# EAGLE design usb300 (EAGLE 4.15)
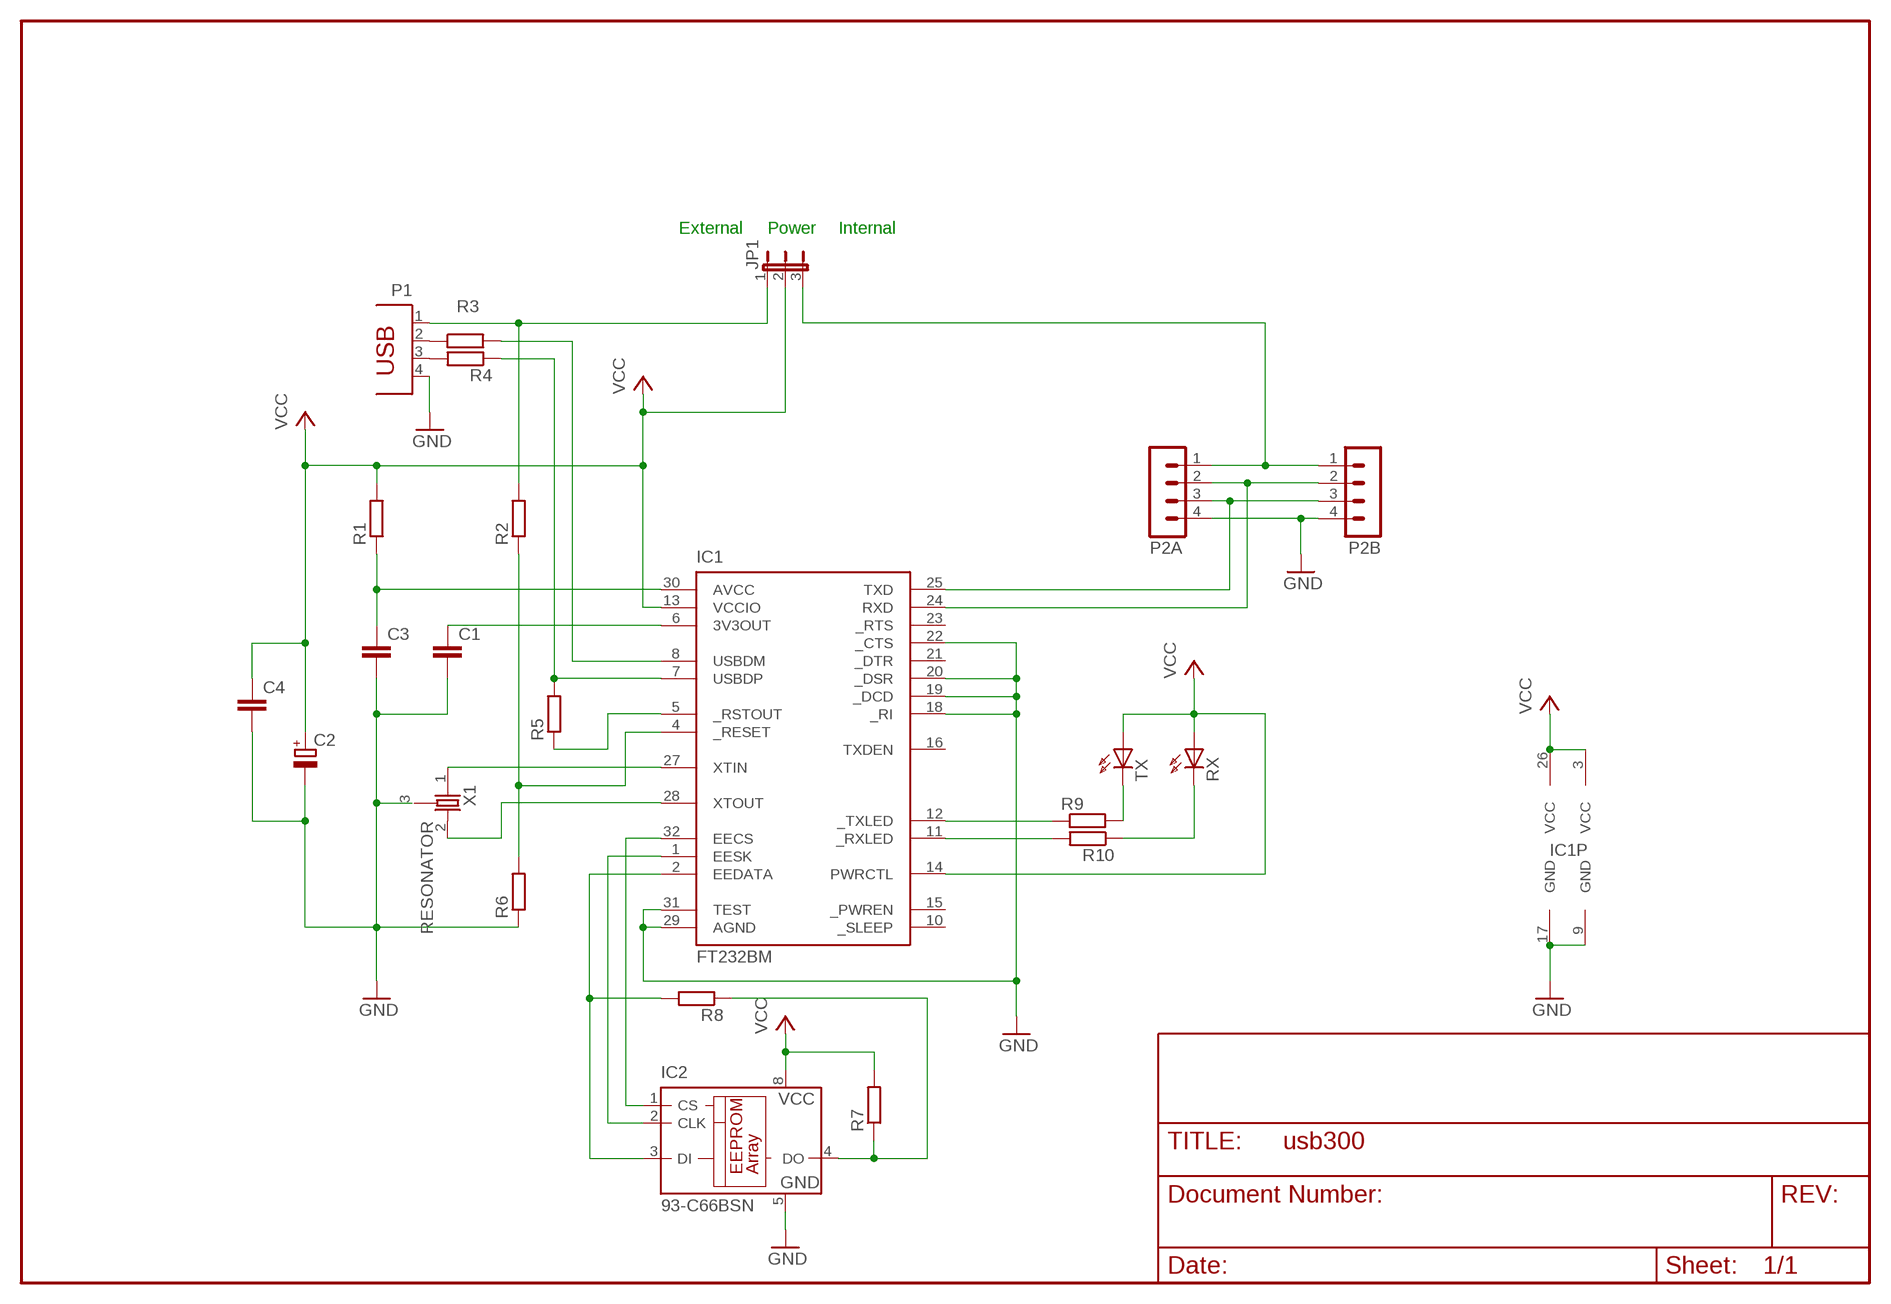
[diagram p0: schematic, sheet 1]

## Parts
C1  C-EUC0805K  [C0805K]
C2  CPOL-EUCT3528  [CT3528]
C3  C-EUC0805K  [C0805K]
C4  C-EUC0805K  [C0805K]
IC1  FT232BM  [LQFP32]
IC2  93-C66BSN  [SO-08]
JP1  JP2E  [JP2]
P1  PN61729  [PN61729]
P2A  MA04-1  [MA04-1]
P2B  MA04-1  [MA04-1]
R1  R-EU_R0805W  [R0805W]
R2  R-EU_R0805W  [R0805W]
R3  R-EU_R0805W  [R0805W]
R4  R-EU_R0805W  [R0805W]
R5  R-EU_R0805W  [R0805W]
R6  R-EU_R0805W  [R0805W]
R7  R-EU_R0805W  [R0805W]
R8  R-EU_R0805W  [R0805W]
R9  R-EU_R0805W  [R0805W]
R10  R-EU_R0805W  [R0805W]
RX  LEDSMT1206  [1206]
TX  LEDSMT1206  [1206]
X1  RESONATOR  [RESONATOR]

## Nets
GND [power]: C1.2 C2.- C3.2 C4.2 IC1.9(GND) IC1.17(GND) IC1.18(_RI) IC1.19(_DCD) IC1.20(_DSR) IC1.22(_CTS) IC1.29(AGND) IC1.31(TEST) IC2.5(GND) P1.4 P2A.4 P2B.4 R6.1 X1.3
N$1: C3.1 IC1.30(AVCC) R1.1
N$2: IC1.25(TXD) P2A.3 P2B.3
N$3: IC1.24(RXD) P2A.2 P2B.2
N$4: IC2.4(DO) R7.1 R8.1
N$5: IC1.27(XTIN) X1.1
N$6: IC1.28(XTOUT) X1.2
N$7: IC1.7(USBDP) R4.1 R5.2
N$8: IC1.5(_RSTOUT) R5.1
N$9: JP1.1 P1.1 R2.2
N$11: IC1.8(USBDM) R3.2
N$12: P1.3 R4.2
N$13: P1.2 R3.1
N$14: IC1.4(_RESET) R2.1 R6.2
N$15: IC1.2(EEDATA) IC2.3(DI) R8.2
N$16: IC1.1(EESK) IC2.2(CLK)
N$17: C1.1 IC1.6(3V3OUT)
N$18: IC1.32(EECS) IC2.1(CS)
N$19: R10.1 RX.C
N$20: R9.2 TX.C
N$22: IC1.12(_TXLED) R9.1
N$23: IC1.11(_RXLED) R10.2
N$24 [power]: JP1.3 P2A.1 P2B.1
VCC: C2.+ C4.1 IC1.3(VCC) IC1.13(VCCIO) IC1.14(PWRCTL) IC1.26(VCC) IC2.8(VCC) JP1.2 R1.2 R7.2 RX.A TX.A
Unconnected: IC1.10(_SLEEP) IC1.15(_PWREN) IC1.16(TXDEN) IC1.21(_DTR) IC1.23(_RTS)

## Notes on the sheet
- External | Power | Internal

## Library data of the parts
C1 C3 C4 = rcl:C-EU: CAPACITOR, European symbol
C2 = rcl:CPOL-EU: POLARIZED CAPACITOR, European symbol
IC1 = ftdi3:FT232BM: USB UART 2nd Generation USB UART (USB <-> Serial)
IC2 = microchip:93-*: Serial EEPROM 512 x 8 bit/256 x 16 bit/1 K/4 K, 5.0 V, Microwire
JP1 = jumper:JP2E: JUMPER
P1 = con-berg:PN61729: BERG
P2A P2B = con-lstb:MA04-1: PIN HEADER
R1-R10 = rcl:R-EU_: RESISTOR, European symbol
RX TX = led:LED: LED
X1 = lbm:RESONATOR

## Net classes
0 default: width 0.203 mm, drill 0.203 mm
1 power: width 0.508 mm, drill 0.203 mm

## Board
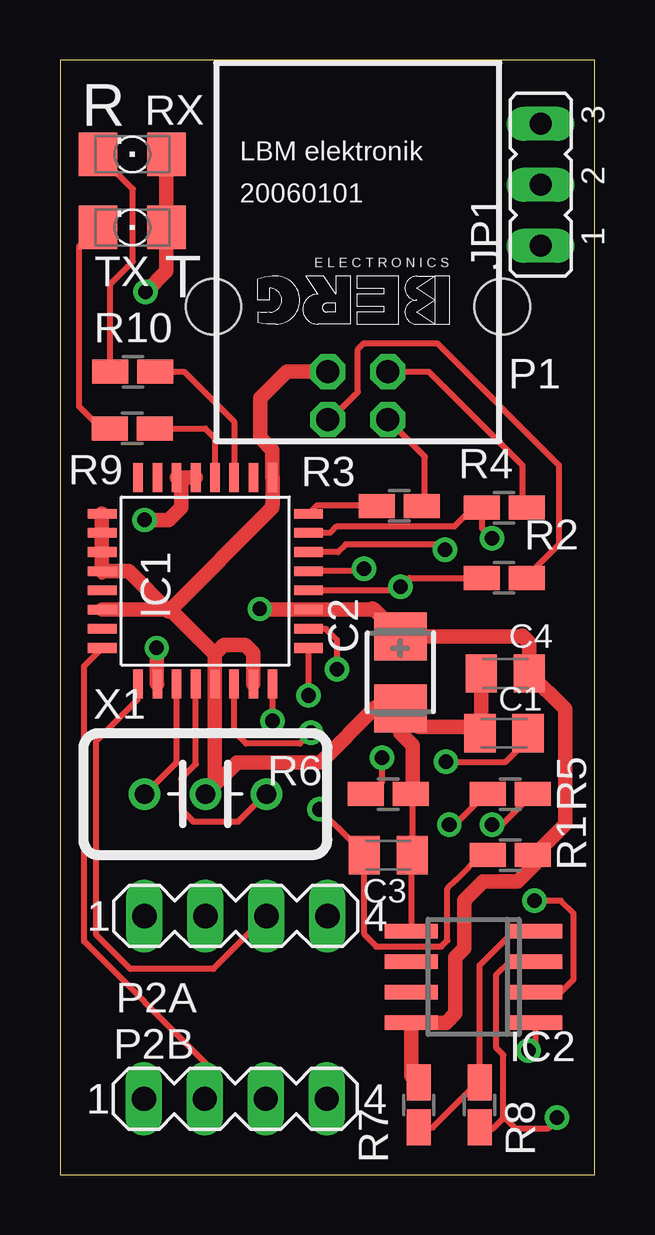
[diagram p1: board, top side]
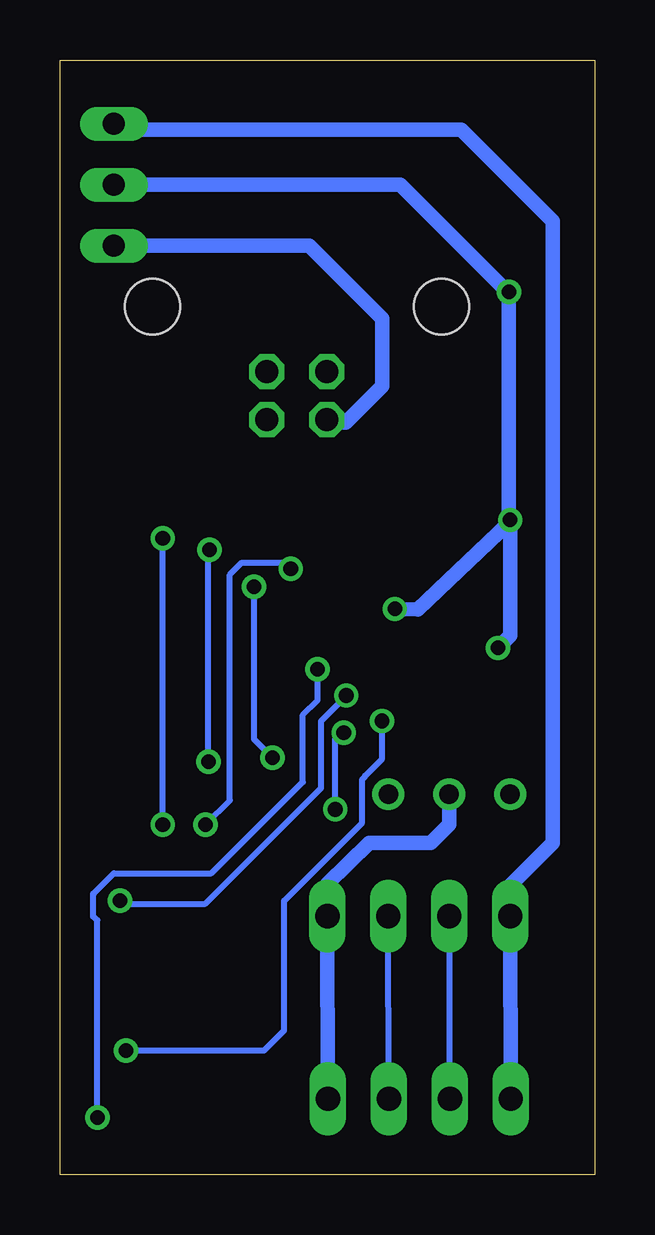
[diagram p2: board, bottom side, seen from below]

Size 22.28 x 46.47 mm. Coordinates in mm from the lower left corner, seen from the top.
Outline: 0,0 22.28,0 22.28,46.47 0,46.47 0,0
Copper layers (1*16): Top 0.035mm / dielectric 1.5mm / Bottom 0.035mm
Design rules "default": minimum track width 8mil, minimum drill 23mil, track to track 8mil, track to pad 8mil, pad to pad 8mil, via to via 8mil, smd to smd 8mil, copper to edge 20mil, drill to drill 8mil, minimum pad ring 10mil, minimum via ring 8mil, stop-mask expansion 4mil, vias tented up to drill 0mil, thermal gap 10mil

### Footprints (pad centres in the part's own frame; a part is rotated, then mirrored left to right if it is on the bottom)
C0805K = smd 1.3 x 1.6: 1 -1,0; 2 1,0
CT3528 = smd 2 x 2.2: + 1.5,0; - -1.5,0
LQFP32 = smd 0.4 x 1.2: 1 -2.8,-4.3; 2 -2,-4.3; 3 -1.2,-4.3; 4 -0.4,-4.3; 5 0.4,-4.3; 6 1.2,-4.3; 7 2,-4.3; 8 2.8,-4.3; 17 2.8,4.3; 18 2,4.3; 19 1.2,4.3; 20 0.4,4.3; 21 -0.4,4.3; 22 -1.2,4.3; 23 -2,4.3; 24 -2.8,4.3 | smd 1.2 x 0.4: 9 4.3,-2.8; 10 4.3,-2; 11 4.3,-1.2; 12 4.3,-0.4; 13 4.3,0.4; 14 4.3,1.2; 15 4.3,2; 16 4.3,2.8; 25 -4.3,2.8; 26 -4.3,2; 27 -4.3,1.2; 28 -4.3,0.4; 29 -4.3,-0.4; 30 -4.3,-1.2; 31 -4.3,-2; 32 -4.3,-2.8
SO-08 = smd 0.6 x 2.2: 1 -1.905,-2.6; 2 -0.635,-2.6; 3 0.635,-2.6; 4 1.905,-2.6; 5 1.905,2.6; 6 0.635,2.6; 7 -0.635,2.6; 8 -1.905,2.6
JP2 = drill 0.914 long: 1 -2.54,0; 2 0,0; 3 2.54,0
PN61729 = drill 0.95 octagon: 1 1.25,4.71; 2 -1.25,4.71; 3 -1.25,2.71; 4 1.25,2.71 | hole 2.3: -6.02,0; 6.02,0
MA04-1 = drill 1.016 long: 1 -3.81,0; 2 -1.27,0; 3 1.27,0; 4 3.81,0
R0805W = smd 1.5 x 1: 1 -0.94,0; 2 0.94,0
1206 = smd 1.6 x 1.803: A -1.422,0; C 1.422,0
RESONATOR = drill 0.813 round: 1 -7.62,0; 2 -2.54,0; 3 -5.08,0

### Placement (x,y rotation side)
C1  18.5,18.41 180 top
C2  14.19,20.95 90 top
C3  13.68,13.33 0 top
C4  18.55,20.9 180 top
IC1  6.06,24.76 90 top
IC2  17.23,8.25 90 top
JP1  20.03,41.27 90 top
P1  12.41,36.19 180 top
P2A  7.33,10.79 0 top
P2B  7.3,3.17 0 top
R1  18.76,13.33 0 top
R2  18.5,24.89 0 top
R3  14.14,27.88 180 top
R4  18.5,27.81 0 top
R5  18.76,15.87 0 top
R6  13.68,15.87 180 top
R7  14.95,2.92 90 top
R8  17.49,2.92 270 top
R9  3.01,31.11 180 top
R10  3.04,33.47 0 top
RX  3.01,42.54 180 top
TX  3.01,39.49 180 top
X1  11.14,15.87 0 top

### Tracks (layer width: path | path; a pad name or v marks a point on that pad's centre or on a via)
GND
  Top 0.254: IC2.5 14.63,13.27 14.69,13.33 C3.2 14.68,15.76 14.57,15.87 R6.1
  Top 0.406: 1.74,27.56 IC1.17 | 1.74,26.76 IC1.18 | 1.74,25.01 1.74,25.16 IC1.20 | 1.74,25.96 IC1.19
  Top 0.61: IC1.31 8.06,21.74 7.71,22.09 6.82,22.09 6.44,21.71 | 6.44,20.44 IC1.29 | 6.44,20.44 6.44,21.71 | 4.53,23.56 4.59,23.56 6.44,21.71 | 4.53,23.56 IC1.22 | P1.4 9.44,33.48 8.34,32.38 8.34,30.73 8.85,30.22 8.85,29.08 8.86,29.07 IC1.9 8.86,27.94 8.85,27.93 8.85,27.81 4.53,23.49 | 17.49,18.66 17.5,18.65 C1.2 | C4.2 17.56,18.73 17.49,18.66 | 14.24,19.45 14.23,19.45 C2.- | 6.44,20.44 6.44,16.25 X1.3 7.38,17.19 10.86,17.19 13.14,19.48 14.19,19.48 C2.- | 4.53,23.56 4.53,23.49 | 1.74,27.56 1.74,26.76 1.74,25.96 1.74,25.16 | IC1.20 2.86,25.16 4.53,23.49 | 14.19,19.43 14.19,18.41 14.69,17.9 14.69,15.87 R6.1 | C2.- 14.19,19.43 | 17.49,18.66 14.95,18.66 14.19,19.43
  Bottom 0.61: P2B.4 P2A.4 11.14,12.14 9.38,13.84 6.82,13.84 6.06,14.6 X1.3
N$1  (via drill 0.61)
  Top 0.254: 16.52,12.31 17.54,13.33 | C3.1 12.69,10.03 13.17,9.52 15.89,9.52 16.14,9.77 16.14,11.93 16.52,12.31 | IC1.30 7.26,18.48 7.76,17.98 9.99,17.98 v10.45,18.43 | C3.1 12.68,13.37 12.69,13.38 11.62,14.45 v10.81,15.24 | 16.52,12.31 16.5,12.29
  Top 0.305: 17.54,13.33 R1.1 | 12.69,13.36 C3.1
  Bottom 0.254: v10.45,18.43 10.81,18.16 v10.81,15.24
N$2
  Top 0.254: P2A.3 6.39,8.58 2.93,8.58 1.51,10 1.51,18.08 3.24,19.81 3.24,20.47 IC1.25
  Bottom 0.254: 8.6,3.15 P2B.3 P2A.3
N$3
  Top 0.254: IC1.24 1,21.2 1,9.72 6.06,4.67 6.06,3.17 P2B.2
  Bottom 0.254: P2A.2 6.06,10.82 6.03,10.79 P2B.2
N$4
  Top 0.254: IC2.4 18.91,10.16 17.49,8.73 17.49,3.88 17.46,3.86 | 17.46,3.86 | 17.46,3.86 R8.1 17.41,3.86 15.53,1.98 15.02,1.98 | 15.02,1.98 | R7.1 15.02,1.98
N$5
  Top 0.254: IC1.27 4.86,17.18 3.52,15.85
  Top 0.305: 3.49,15.82 3.52,15.85 X1.1
N$6
  Top 0.254: IC1.28 5.66,17.12 5.14,16.61 | 5.07,16.5 5.07,15.21 5.55,14.73 7.43,14.73 8.6,15.9
  Top 0.305: 5.14,16.61 5.14,16.58 5.07,16.5 | 8.6,15.9 X1.2
N$7  (via drill 0.61)
  Top 0.254: IC1.7 11.26,26.76 11.52,27.02 16.42,27.02 17.18,27.78 17.59,27.78 | 17.59,27.78 | 17.59,27.78 R4.1 17.59,27.81 17.59,26.94 v18,26.54 | R5.2 18.43,14.6 v18,14.6
  Bottom 0.254: v18,14.6 v18,26.54
N$8  (via drill 0.61)
  Top 0.254: IC1.5 12.55,25.16 v12.66,25.27 | R5.1 17.74,15.87 16.47,14.6 v16.22,14.6
  Bottom 0.254: v12.66,25.27 12.92,25.52 14.69,25.52 15.2,25.01 15.2,15.62 v16.22,14.6
N$9
  Top 0.254: P1.1 11.25,31.48 12.41,32.63 12.41,34.41 12.66,34.67 15.71,34.67 20.79,29.59 20.79,26.28 19.44,24.94 R2.2
  Bottom 0.61: JP1.1 11.9,38.73 8.85,35.68 8.85,32.89 10.38,31.36 11.14,31.36 11.14,31.46 P1.1
N$11
  Top 0.254: R3.2 13.2,27.91 10.71,27.91 IC1.8 | R3.2
N$12
  Top 0.254: P1.3 15.37,33.48 19.27,29.59 19.27,28.06 19.52,27.81 R4.2
N$13
  Top 0.254: R3.1 15.15,27.81 15.2,27.81 15.2,29.94 P1.2
N$14  (via drill 0.61)
  Top 0.254: IC1.4 14.04,24.36 v14.19,24.51 14.57,24.89 R2.1 | v13.42,17.39 13.42,16.38 12.92,15.87 R6.2 12.66,15.87
  Bottom 0.254: v14.19,24.51 14.19,18.16 v13.42,17.39
N$15  (via drill 0.61)
  Top 0.254: IC2.3 18.73,8.89 18.17,8.33 18.17,5.3 18.48,5 18.48,2.41 | 18.48,2.41 18.48,2.33 | IC1.2 11.08,22.76 11.54,22.3 v11.54,21.08 | v20.71,2.38 20.36,1.95 18.96,1.95 18.5,2.41 | 18.5,2.41 18.48,2.41 | 18.5,2.41 18.05,1.95 18,1.9 17.92,1.98 R8.2
  Bottom 0.254: v20.71,2.38 20.71,10.61 20.89,10.77 20.89,11.73 20.87,11.73 20.03,12.57 15.96,12.57 12.15,16.38 12.15,19.17 11.54,19.78 v11.54,21.08
N$16  (via drill 0.61)
  Top 0.254: IC1.1 10.36,19.99 v10.35,19.98 | v19.77,11.43 20.87,11.43 21.4,10.89 21.4,8.15 20.87,7.62 IC2.2
  Bottom 0.254: v10.35,19.98 10.35,19.96 11.39,18.92 11.39,16.12 16.22,11.3 19.77,11.3 v19.77,11.43
N$17  (via drill 0.61)
  Top 0.254: 19.47,18.45 19.47,18.46 | 19.47,18.45 C1.1 | v16.09,17.22 18.58,17.22 19.47,18.11 19.47,18.45 | IC1.6 11.58,25.96 11.9,26.28 15.71,26.28 15.94,26.05 v16.04,26.05
  Bottom 0.254: v16.04,26.05 16.09,26.18 v16.09,17.22
N$18  (via drill 0.61)
  Top 0.254: IC1.32 8.86,19.28 v8.85,18.92 | IC2.1 19.83,6.36 19.83,6.37 19.83,5.48 v19.52,5.18
  Bottom 0.254: v8.85,18.92 8.85,17.34 9.56,16.63 9.56,16.61 9.69,16.48 9.69,14.68 12.94,11.43 12.94,6.01 13.78,5.18 v19.52,5.18
N$19
  Top 0.254: RX.C 3.04,41.09 3.04,38.07 2.1,37.13 2.1,33.57 2.09,33.57 R10.1
N$20
  Top 0.254: TX.C 0.8,38.7 0.8,32.02 1.71,31.11 R9.2
N$22
  Top 0.254: IC1.12 6.46,30.71 6.06,31.11 R9.1
N$23
  Top 0.254: R10.2 5.17,33.47 7.25,31.39 IC1.11
N$24
  Bottom 0.61: P2B.1 P2A.1 3.52,12.06 1.74,13.84 1.74,39.75 5.55,43.56 19.77,43.56 JP1.3
VCC  (via drill 0.6, 0.61)
  Top 0.61: 13.16,23.48 13.02,23.62 | 4.43,39.57 | 4.43,39.57 TX.A 4.43,37.66 v3.57,36.8 | RX.A 4.43,39.57 | v3.52,27.3 4.53,27.3 5.04,27.81 5.04,28.88 IC1.14 4.9,29.06 4.92,29.08 4.93,29.06 IC1.13 | IC1.26 4.03,20.49 v4.03,21.97 | v8.33,23.59 8.33,23.51 8.34,23.49 8.41,23.56 IC1.3 13.1,23.56 13.17,23.49 13.16,23.48 | 13.16,23.48 13.18,23.48 14.19,22.47 C2.+ 19.24,22.45 19.27,22.47 19.56,22.18 C4.1 21.04,19.41 21.04,14.6 19.77,13.33 R1.2 19.7,13.03 19.77,12.95 19.06,12.24 17.64,12.24 16.85,11.45 16.85,9.44 16.47,9.06 16.47,6.73 16.09,6.34 IC2.8 14.63,4.12 14.95,3.8 R7.2
  Bottom 0.61: 3.57,27.55 3.57,27.17 7.38,23.57 v8.33,23.59 | 3.57,27.55 v3.57,36.8 3.57,36.75 | 3.57,36.75 3.52,36.7 | JP1.2 8.09,41.27 3.57,36.75 | 3.57,27.55 3.52,27.55 v3.52,27.3 3.52,22.47 v4.03,21.97

### Text on the board
tNames: R | LBM elektronik | 20060101 | T
tValues: 1